# EAGLE design midi_pad_laser_optimized2 (EAGLE 9.6.2)
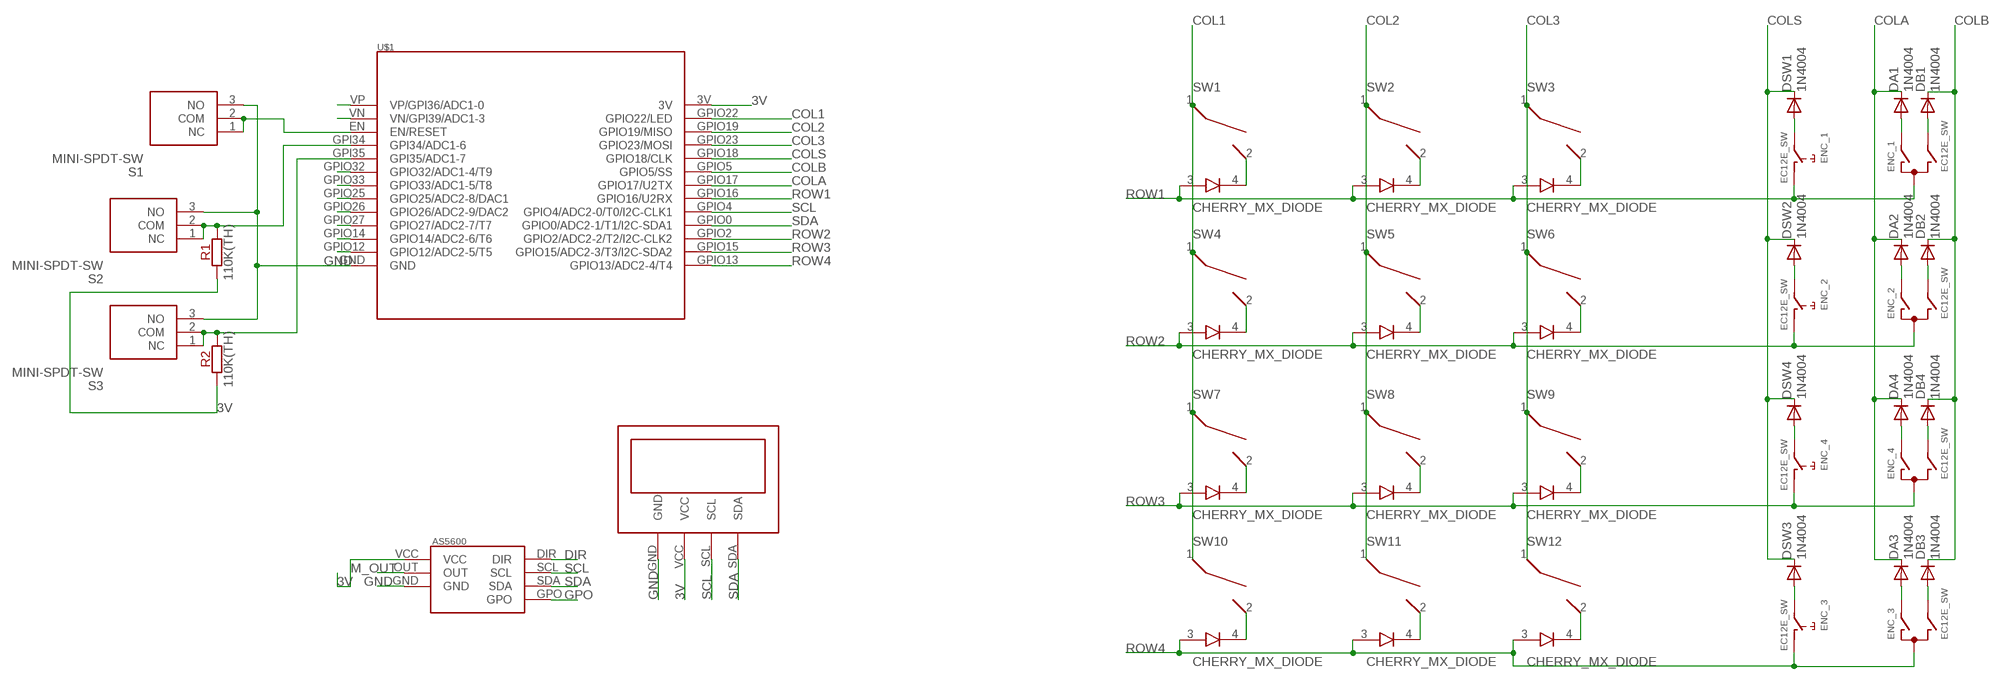
[diagram p0: schematic, sheet 1]

## Parts
DA1  1N4004  [DO41-10]
DA2  1N4004  [DO41-10]
DA3  1N4004  [DO41-10]
DA4  1N4004  [DO41-10]
DB1  1N4004  [DO41-10]
DB2  1N4004  [DO41-10]
DB3  1N4004  [DO41-10]
DB4  1N4004  [DO41-10]
DSW1  1N4004  [DO41-10]
DSW2  1N4004  [DO41-10]
DSW3  1N4004  [DO41-10]
DSW4  1N4004  [DO41-10]
ENC_1  EC12E_SW  [ALPS_EC12E_SW]
ENC_2  EC12E_SW  [ALPS_EC12E_SW]
ENC_3  EC12E_SW  [ALPS_EC12E_SW]
ENC_4  EC12E_SW  [ALPS_EC12E_SW]
R1  110K(TH)  [R-0207/10]
R2  110K(TH)  [R-0207/10]
S1  MINI-SPDT-SW  [MINISPDTSW]
S2  MINI-SPDT-SW  [MINISPDTSW]
S3  MINI-SPDT-SW  [MINISPDTSW]
SW1  CHERRY_MX_DIODE  [MX1A-XX[D/J]N]
SW2  CHERRY_MX_DIODE  [MX1A-XX[D/J]N]
SW3  CHERRY_MX_DIODE  [MX1A-XX[D/J]N]
SW4  CHERRY_MX_DIODE  [MX1A-XX[D/J]N]
SW5  CHERRY_MX_DIODE  [MX1A-XX[D/J]N]
SW6  CHERRY_MX_DIODE  [MX1A-XX[D/J]N]
SW7  CHERRY_MX_DIODE  [MX1A-XX[D/J]N]
SW8  CHERRY_MX_DIODE  [MX1A-XX[D/J]N]
SW9  CHERRY_MX_DIODE  [MX1A-XX[D/J]N]
SW10  CHERRY_MX_DIODE  [MX1A-XX[D/J]N]
SW11  CHERRY_MX_DIODE  [MX1A-XX[D/J]N]
SW12  CHERRY_MX_DIODE  [MX1A-XX[D/J]N]
U$1  LOLIN32_LITE  [LOLIN32_LITE]
U$2  AS5600_BREAKOUT  [AS5600_BREAKOUT]
U$3  I2C_OLED_128X64  [I2C_OLED_128X64_BREAKOUT]

## Nets
3V: R1.1 R2.1 U$1.3V U$2.VCC U$3.VCC
COL1: SW1.1 SW4.1 SW7.1 SW10.1 U$1.GPIO22(GPIO22/LED)
COL2: SW2.1 SW5.1 SW8.1 SW11.1 U$1.GPIO19(GPIO19/MISO)
COL3: SW3.1 SW6.1 SW9.1 SW12.1 U$1.GPIO23(GPIO23/MOSI)
COLA: DA1.C DA2.C DA3.C DA4.C U$1.GPIO17(GPIO17/U2TX)
COLB: DB1.C DB2.C DB3.C DB4.C U$1.GPIO5(GPIO5/SS)
COLS: DSW1.C DSW2.C DSW3.C DSW4.C U$1.GPIO18(GPIO18/CLK)
DIR: U$2.DIR
GND: S1.3(NO) S2.3(NO) S3.3(NO) U$1.GND U$2.GND U$3.GND
GPO: U$2.GPO
M_OUT: U$2.OUT
N$1: SW1.2 SW1.4
N$2: SW2.2 SW2.4
N$3: SW3.2 SW3.4
N$4: SW4.2 SW4.4
N$5: SW5.2 SW5.4
N$6: SW6.2 SW6.4
N$7: SW7.2 SW7.4
N$8: SW8.2 SW8.4
N$9: SW9.2 SW9.4
N$10: SW10.2 SW10.4
N$11: SW11.2 SW11.4
N$12: SW12.2 SW12.4
N$13: U$1.GPIO32(GPIO32/ADC1-4/T9)
N$14: S1.1(NC) S1.2(COM) U$1.EN(EN/RESET)
N$15: R1.2 S2.1(NC) S2.2(COM) U$1.GPI34(GPI34/ADC1-6)
N$16: R2.2 S3.1(NC) S3.2(COM) U$1.GPI35(GPI35/ADC1-7)
N$20: DSW1.A ENC_1.E
N$21: DA1.A ENC_1.A
N$22: DB1.A ENC_1.B
N$23: DSW2.A ENC_2.E
N$24: DA2.A ENC_2.A
N$25: DB2.A ENC_2.B
N$26: DSW3.A ENC_3.E
N$27: DA3.A ENC_3.A
N$28: DB3.A ENC_3.B
N$29: DSW4.A ENC_4.E
N$30: DA4.A ENC_4.A
N$31: DB4.A ENC_4.B
N$34: U$1.GPIO33(GPIO33/ADC1-5/T8)
N$35: U$1.GPIO25(GPIO25/ADC2-8/DAC1)
N$36: U$1.GPIO26(GPIO26/ADC2-9/DAC2)
N$43: U$1.GPIO27(GPIO27/ADC2-7/T7)
N$44: U$1.GPIO14(GPIO14/ADC2-6/T6)
N$45: U$1.GPIO12(GPIO12/ADC2-5/T5)
N$46: U$1.VN(VN/GPI39/ADC1-3)
N$47: U$1.VP(VP/GPI36/ADC1-0)
ROW1: ENC_1.C ENC_1.D SW1.3 SW2.3 SW3.3 U$1.GPIO16(GPIO16/U2RX)
ROW2: ENC_2.C ENC_2.D SW4.3 SW5.3 SW6.3 U$1.GPIO2(GPIO2/ADC2-2/T2/I2C-CLK2)
ROW3: ENC_4.C ENC_4.D SW7.3 SW8.3 SW9.3 U$1.GPIO15(GPIO15/ADC2-3/T3/I2C-SDA2)
ROW4: ENC_3.C ENC_3.D SW10.3 SW11.3 SW12.3 U$1.GPIO13(GPIO13/ADC2-4/T4)
SCL: U$1.GPIO4(GPIO4/ADC2-0/T0/I2C-CLK1) U$2.SCL U$3.SCL
SDA: U$1.GPIO0(GPIO0/ADC2-1/T1/I2C-SDA1) U$2.SDA U$3.SDA
Unconnected: ENC_1.GND1(G) ENC_1.GND2(G) ENC_2.GND1(G) ENC_2.GND2(G) ENC_3.GND1(G) ENC_3.GND2(G) ENC_4.GND1(G) ENC_4.GND2(G)

## Library data of the parts
DA1-DA4 DB1-DB4 DSW1-DSW4 = adafruit:1N4004: DIODE General purpose 1N400x type rectifier (With bigger pads) http://www.ladyada.net/library/pcb/eaglelibrary.html
ENC_1-ENC_4 = my-switch-alps:EC12E_SW: ALPS rotary Encoder EC12E series with switch; MPN: EC12E2424407; OC_FARNELL: 1520813; OC_NEWARK: 74M1068
R1 R2 = resistors:?
S1-S3 = SamacSys_Parts:MINI-SPDT-SW: Slide Switches MINI SPDT SWITCH Source: Datasheet <http://site.gravitech.us/Components/MINI-SPDT-SW/EG1218_datasheet.pdf>; DESCRIPTION: Slide Switches MINI SPDT SWITCH; HEIGHT: mm; MANUFACTURER_NAME: Gravitech; MANUFACTURER_PART_NUMBER: MINI-SPDT-SW; MOUSER_PART_NUMBER: 992-MINI-SPDT-SW; MOUSER_PRICE-STOCK: https://www.mouser.co.uk/ProductDetail/Gravitech/MINI-SPDT-SW?qs=Vxac6xGyzPm8ENq695r3yA%3D%3D
SW1-SW12 = Cherry_MX_v7.0:CHERRY_MX_DIODE
U$1 = my_breakouts:LOLIN32_LITE
U$2 = my_breakouts:AS5600_BREAKOUT
U$3 = my_breakouts:I2C_OLED_128X64

## Board
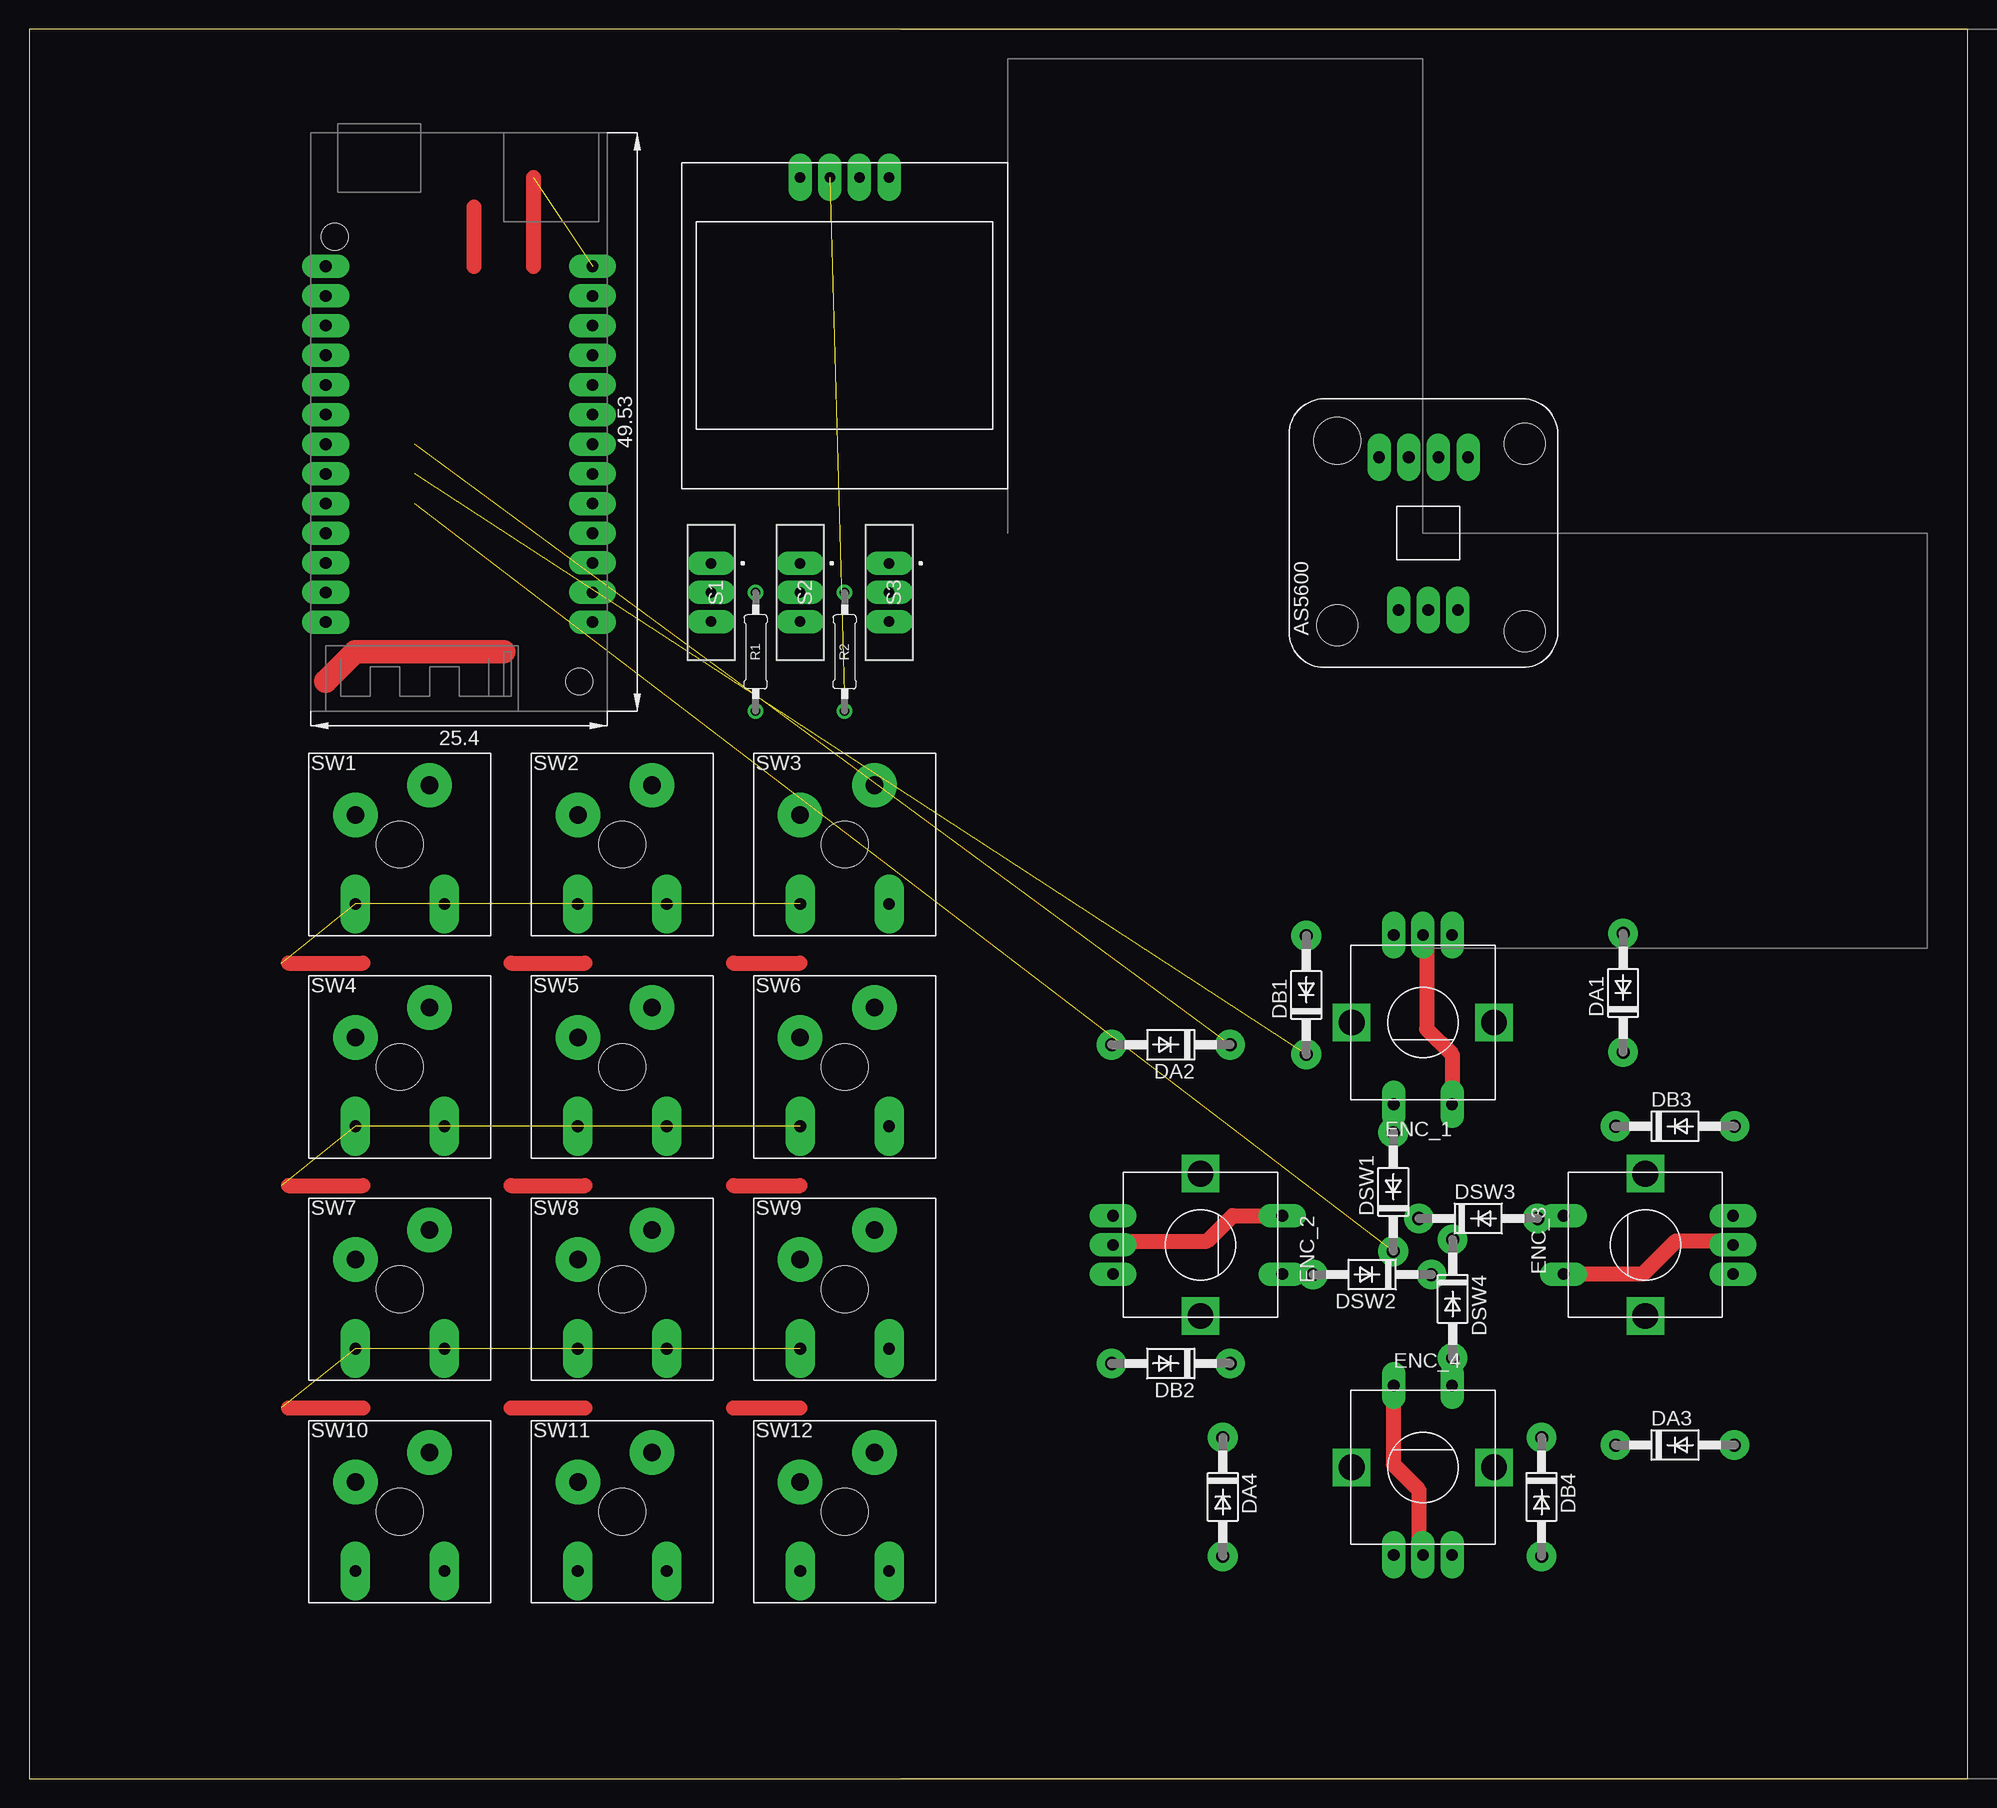
[diagram p1: board, top side]
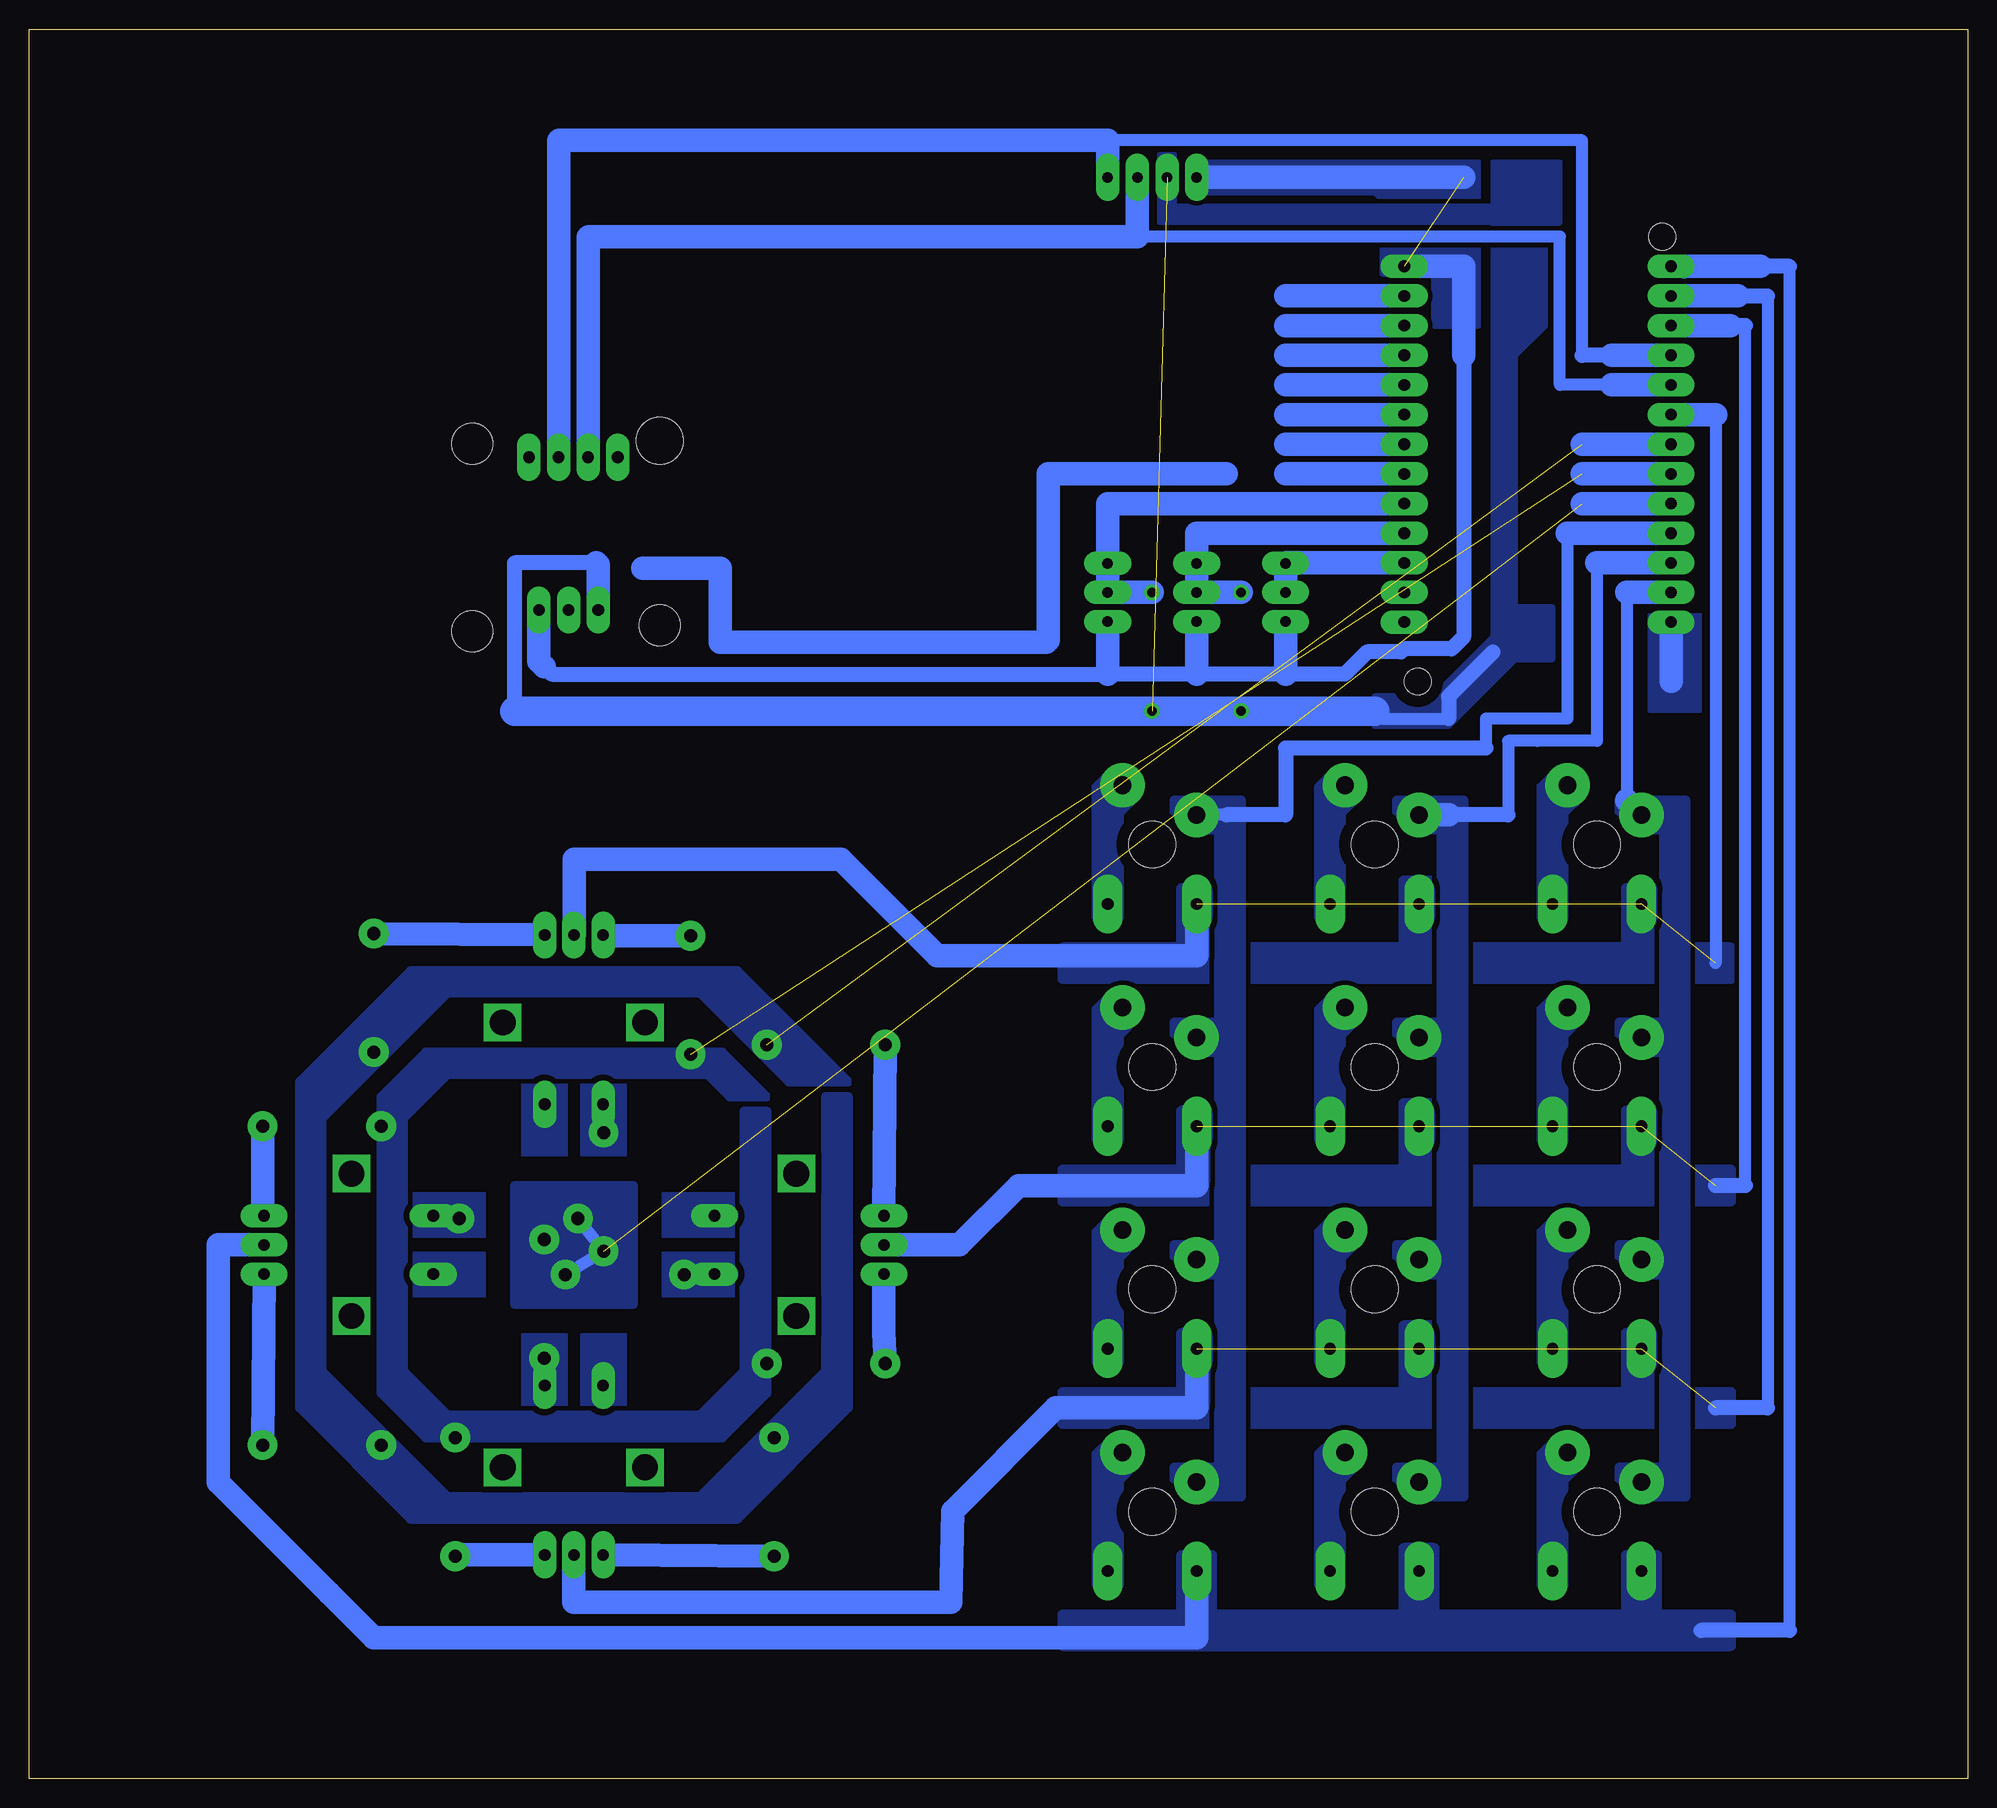
[diagram p2: board, bottom side, seen from below]

Size 166.04 x 149.85 mm. Coordinates in mm from the lower left corner, seen from the top.
Outline: 0,0 166.04,0 166.04,149.85 0,149.85 0,0
Copper layers (1*16): Top 0.035mm / dielectric 1.5mm / Bottom 0.035mm
Design rules "default *": minimum track width 6mil, minimum drill 0.35mm, track to track 0.4mm, track to pad 0.4mm, pad to pad 0.4mm, via to via 0.4mm, smd to smd 6mil, copper to edge 40mil, drill to drill 6mil, minimum pad ring 10mil, minimum via ring 8mil, stop-mask expansion 4mil, vias tented up to drill 0mil, thermal gap 10mil

### Footprints (pad centres in the part's own frame; a part is rotated, then mirrored left to right if it is on the bottom)
DO41-10 = drill 1.118 pad 2.54: A 5.08,0; C -5.08,0
ALPS_EC12E_SW = drill 1 pad 2.032 long: A -2.5,-7.5; B 2.5,-7.5; C 0,-7.5; D -2.5,7; E 2.5,7 | drill 2.2 square: GND1 -6.1,0; GND2 6.1,0
R-0207/10 = drill 0.813: 1 -5.08,0; 2 5.08,0
MINISPDTSW = drill 0.9 pad 2.032 long: 1 -2.5,0; 2 0,0; 3 2.5,0
MX1A-XX[D/J]N = drill 1.5 pad 3.81: 1 -3.81,2.54; 2 2.54,5.08 | drill 1 pad 2.54 long: 3 -3.81,-5.08; 4 3.81,-5.08 | hole 4: 0,0
LOLIN32_LITE = drill 1 pad 2.032 long: 3V 10.16,15.24; EN -12.7,10.16; GND -12.7,-15.24; GPI34 -12.7,7.62; GPI35 -12.7,5.08; GPIO0 10.16,-7.62; GPIO2 10.16,-10.16; GPIO4 10.16,-5.08; GPIO5 10.16,2.54; GPIO12 -12.7,-12.7; GPIO13 10.16,-15.24; GPIO14 -12.7,-10.16; GPIO15 10.16,-12.7; GPIO16 10.16,-2.54; GPIO17 10.16,0; GPIO18 10.16,5.08; GPIO19 10.16,10.16; GPIO22 10.16,12.7; GPIO23 10.16,7.62; GPIO25 -12.7,-2.54; GPIO26 -12.7,-5.08; GPIO27 -12.7,-7.62; GPIO32 -12.7,2.54; GPIO33 -12.7,0; VN -12.7,12.7; VP -12.7,15.24 | hole 2.286: 9.398,-17.78; -11.557,20.32
AS5600_BREAKOUT = drill 1 pad 2.032 long: DIR 6.504,3.758; GND -6.571,-2.995; GPO 6.504,-3.862; OUT -6.571,-0.455; SCL 6.504,1.218; SDA 6.504,-1.322; VCC -6.571,2.085 | hole 3.5: -8.401,-8.703; -7.893,7.351; 7.653,-8.703 | hole 4: 7.907,7.351
I2C_OLED_128X64_BREAKOUT = drill 0.9 pad 2.032 long: GND 3.81,-12.7; SCL -1.27,-12.7; SDA -3.81,-12.7; VCC 1.27,-12.7

### Placement (x,y rotation side)
DA1  136.53,67.31 90 top
DA2  97.79,62.87 180 top
DA3  140.97,28.57 0 top
DA4  102.23,24.13 270 top
DB1  109.39,67.12 90 top
DB2  97.79,35.56 180 top
DB3  140.97,55.88 0 top
DB4  129.54,24.13 270 top
DSW1  116.84,50.26 90 top
DSW2  115.03,43.18 180 top
DSW3  124.12,47.98 0 top
DSW4  121.92,41.1 270 top
ENC_1  119.38,64.77 180 top
ENC_2  100.33,45.72 270 top
ENC_3  138.43,45.72 90 top
ENC_4  119.38,26.67 0 top
R1  62.23,96.52 90 top
R2  69.85,96.52 90 top
S1  58.42,101.6 270 top
S2  66.04,101.6 270 top
S3  73.66,101.6 270 top
SW1  31.75,80.01 0 top
SW2  50.8,80.01 0 top
SW3  69.85,80.01 0 top
SW4  31.75,60.96 0 top
SW5  50.8,60.96 0 top
SW6  69.85,60.96 0 top
SW7  31.75,41.91 0 top
SW8  50.8,41.91 0 top
SW9  69.85,41.91 0 top
SW10  31.75,22.86 0 top
SW11  50.8,22.86 0 top
SW12  69.85,22.86 0 top
U$1  35.56,114.3 180 top
U$2  119.38,106.68 90 top
U$3  69.85,124.46 180 top

### Tracks (layer width: path | path; a pad name or v marks a point on that pad's centre or on a via)
3V  (3 unrouted)
  Top 2: 25.4,93.98 27.94,96.52 40.64,96.52
  Bottom 1.016: 44.45,90.81 50.16,90.81 50.8,91.44
  Bottom 1.27: 40.64,96.52 44.32,92.84 44.32,92.82 44.45,92.7 44.45,90.81 | 124.46,91.44 124.46,104.14 117.47,104.14 | R2.1 63.5,91.44
  Bottom 2: U$1.3V 25.4,93.98 | U$2.VCC 117.3,103.96 117.47,104.14
  Bottom 2.54: 50.8,91.44 R1.1 63.5,91.44 124.46,91.44
  pour Bottom (isolate 0.406, no thermals): 67.94,139.06 69.22,139.06 69.22,133.35 40.64,133.35 40.64,97.79 45.72,92.71 50.8,92.71 50.8,90.17 44.45,90.17 38.73,95.89 35.56,95.89 35.56,100.33 38.73,100.33 38.73,121.92 36.2,124.46 36.2,132.08 34.92,133.35 34.92,138.43 40.64,138.43 40.64,134.62 67.94,134.62
  pour Bottom (isolate 0.406, no thermals): 22.86,99.69 27.3,99.69 27.3,91.44 22.86,91.44
COL1
  Bottom 1.016: 29.21,101.6 29.21,83.82
  Bottom 2: U$1.GPIO22 29.21,101.6 | 29.21,83.82 SW1.1
  pour Bottom (isolate 0.533, no thermals): 24.13,24.13 29.84,24.13 29.84,26.67 26.04,26.67 26.04,43.18 29.84,43.18 29.84,45.72 26.04,45.72 26.04,62.23 29.84,62.23 29.84,64.77 26.04,64.77 26.04,81.28 29.84,81.28 29.84,83.82 24.13,83.82
COL2
  Bottom 1.016: 39.37,82.55 39.37,88.9 36.83,88.9 31.75,88.9 31.75,104.14
  Bottom 1.27: 39.37,82.55 44.45,82.55
  Bottom 2: U$1.GPIO19 31.75,104.14 | 44.45,82.55 SW2.1
  pour Bottom (isolate 0.533, no thermals): 43.18,24.13 48.9,24.13 48.9,26.67 45.09,26.67 45.09,43.18 48.9,43.18 48.9,45.72 45.09,45.72 45.09,62.23 48.9,62.23 48.9,64.77 45.09,64.77 45.09,81.28 48.9,81.28 48.9,83.82 43.18,83.82
COL3
  Bottom 1.016: 34.29,106.68 34.29,90.81 41.27,90.81 41.27,88.27 | 63.5,82.55 SW3.1
  Bottom 1.27: 41.27,88.27 58.42,88.27 58.42,82.55 63.5,82.55
  Bottom 2: U$1.GPIO23 34.29,106.68
  pour Bottom (isolate 0.533, no thermals): 62.23,24.13 67.94,24.13 67.94,26.67 64.14,26.67 64.14,43.18 67.94,43.18 67.94,45.72 64.14,45.72 64.14,62.23 67.94,62.23 67.94,64.77 64.14,64.77 64.14,81.28 67.94,81.28 67.94,83.82 62.23,83.82
COLA  (1 unrouted)
  Bottom 2: U$1.GPIO17 33.02,114.3
  pour Bottom (isolate 0.533, no thermals): 95.89,58.42 97.79,58.42 97.79,34.92 108.58,24.13 130.18,24.13 140.97,34.92 140.97,56.52 130.18,67.31 108.58,67.31 100.97,59.69 95.89,59.69 105.41,69.22 133.35,69.22 142.88,59.69 142.88,31.75 133.35,22.23 105.41,22.23 95.89,31.75
COLB  (1 unrouted)
  Bottom 2: U$1.GPIO5 33.02,111.76
  pour Bottom (isolate 0.533, rank 2, no thermals): 102.87,57.15 104.78,57.15 104.78,34.92 108.58,31.11 130.18,31.11 133.99,34.92 133.99,56.52 130.18,60.33 107.95,60.33 106.05,58.42 102.87,58.42 106.68,62.23 132.08,62.23 135.89,58.42 135.89,33.02 132.08,29.21 106.68,29.21 102.87,33.02
COLS  (1 unrouted)
  Bottom 1.016: DSW2.C DSW1.C DSW3.C
  Bottom 2: U$1.GPIO18 33.02,109.22
  pour Bottom (isolate 0.533, rank 3, no thermals): 114.3,50.8 114.3,40.64 124.46,40.64 124.46,50.8
GND  (1 unrouted)
  Bottom 1.27: 43.18,121.92 43.18,97.79 44.2,96.77 48.27,96.77 48.53,96.52 51.44,96.52 53.34,94.61 58.42,94.61 66.04,94.61 73.66,94.61 121.28,94.61 121.92,95.25
  Bottom 2: U$1.GND 43.18,129.54 43.18,121.92 | S1.3 58.42,94.61 | S2.3 66.04,94.61 | S3.3 73.66,94.61 | U$3.GND 43.18,137.16 | U$2.GND 122.38,95.7 121.92,95.25
  pour Bottom (isolate 0.406, rank 2, no thermals): 50.16,128.91 45.72,128.91 45.72,124.46 41.91,124.46 41.91,138.43 66.67,138.43 66.67,135.89 50.8,135.89 50.16,135.25
N$1
  pour Bottom (isolate 0.406, rank 3, no thermals): 33.02,86.36 33.02,83.82 34.29,82.55 34.29,73.66 36.83,73.66 36.83,85.09 35.56,86.36
N$2
  pour Bottom (isolate 0.406, rank 3, no thermals): 52.07,86.36 52.07,83.82 53.34,82.55 53.34,73.66 55.88,73.66 55.88,85.09 54.61,86.36
N$3
  pour Bottom (isolate 0.406, rank 3, no thermals): 71.12,86.36 71.12,83.82 72.39,82.55 72.39,73.66 74.93,73.66 74.93,85.09 73.66,86.36
N$4
  pour Bottom (isolate 0.406, rank 3, no thermals): 33.02,67.31 33.02,64.77 34.29,63.5 34.29,54.61 36.83,54.61 36.83,66.04 35.56,67.31
N$5
  pour Bottom (isolate 0.406, rank 3, no thermals): 52.07,67.31 52.07,64.77 53.34,63.5 53.34,54.61 55.88,54.61 55.88,66.04 54.61,67.31
N$6
  pour Bottom (isolate 0.406, rank 3, no thermals): 71.12,67.31 71.12,64.77 72.39,63.5 72.39,54.61 74.93,54.61 74.93,66.04 73.66,67.31
N$7
  pour Bottom (isolate 0.406, rank 3, no thermals): 33.02,48.26 33.02,45.72 34.29,44.45 34.29,35.56 36.83,35.56 36.83,46.99 35.56,48.26
N$8
  pour Bottom (isolate 0.406, rank 3, no thermals): 52.07,48.26 52.07,45.72 53.34,44.45 53.34,35.56 55.88,35.56 55.88,46.99 54.61,48.26
N$9
  pour Bottom (isolate 0.406, rank 3, no thermals): 71.12,48.26 71.12,45.72 72.39,44.45 72.39,35.56 74.93,35.56 74.93,46.99 73.66,48.26
N$10
  pour Bottom (isolate 0.406, rank 3, no thermals): 33.02,29.21 33.02,26.67 34.29,25.4 34.29,16.51 36.83,16.51 36.83,27.94 35.56,29.21
N$11
  pour Bottom (isolate 0.406, rank 3, no thermals): 52.07,29.21 52.07,26.67 53.34,25.4 53.34,16.51 55.88,16.51 55.88,27.94 54.61,29.21
N$12
  pour Bottom (isolate 0.406, rank 3, no thermals): 71.12,29.21 71.12,26.67 72.39,25.4 72.39,16.51 74.93,16.51 74.93,27.94 73.66,29.21
N$13
  Bottom 2: U$1.GPIO32 58.42,111.76
N$14
  Bottom 2: 58.34,101.68 S1.2 S1.1 58.38,104.14 U$1.EN 53.95,104.14
N$15
  Bottom 2: U$1.GPI34 66.04,106.68 S2.1 S2.2 R1.2
N$16
  Bottom 2: R2.2 S3.2 S3.1 73.66,109.22 U$1.GPI35
N$17
  Top 1.27: 38.1,134.62 38.1,129.54
N$18
  Top 1.27: 43.18,137.16 43.18,129.54
N$19
  Top 1.27: 22.23,69.85 28.57,69.85
N$20
  Bottom 1.016: ENC_1.E DSW1.A
  pour Bottom (isolate 0.406, rank 4, no thermals): 114.94,53.34 118.75,53.34 118.75,59.69 114.94,59.69
N$21
  Bottom 2: ENC_1.A DA1.A
N$22
  Bottom 0.813: 116.83,72.22 ENC_1.B
  Bottom 2: DB1.A 116.83,72.22
N$23
  Bottom 1.016: ENC_2.E DSW2.A
  pour Bottom (isolate 0.406, rank 4, no thermals): 105.41,45.09 105.41,41.27 111.76,41.27 111.76,45.09
N$24
  Bottom 2: DA2.A ENC_2.A
N$25
  Bottom 2: ENC_2.B 92.83,38.22 DB2.A
N$26
  Bottom 1.016: DSW3.A ENC_3.E
  pour Bottom (isolate 0.406, rank 4, no thermals): 127,50.16 127,46.35 133.35,46.35 133.35,50.16
N$27
  Bottom 1.016: ENC_3.A
  Bottom 2: DA3.A ENC_3.A
N$28
  Bottom 0.813: 146.05,48.34 ENC_3.B
  Bottom 2: DB3.A 146.05,48.34
N$29
  Bottom 1.016: DSW4.A ENC_4.E
  pour Bottom (isolate 0.406, rank 4, no thermals): 120.02,31.75 123.83,31.75 123.83,38.1 120.02,38.1
N$30
  Bottom 1.016: ENC_4.A
  Bottom 2: ENC_4.A DA4.A
N$31
  Bottom 0.813: 128.92,19.17 DB4.A
  Bottom 2: ENC_4.B 128.92,19.17
N$32
  Top 1.27: 41.27,69.85 47.62,69.85
N$33
  Top 1.27: 60.33,69.85 66.04,69.85
N$34
  Bottom 2: U$1.GPIO33 58.42,114.3
N$35
  Bottom 2: U$1.GPIO25 58.42,116.84
N$36
  Bottom 2: U$1.GPIO26 58.42,119.38
N$37
  Top 1.27: 22.23,50.8 28.57,50.8
N$38
  Top 1.27: 41.27,50.8 47.62,50.8
N$39
  Top 1.27: 60.33,50.8 66.04,50.8
N$40
  Top 1.27: 22.23,31.75 28.57,31.75
N$41
  Top 1.27: 41.27,31.75 47.62,31.75
N$42
  Top 1.27: 60.33,31.75 66.04,31.75
N$43
  Bottom 2: U$1.GPIO27 58.42,121.92
N$44
  Bottom 2: U$1.GPIO14 58.42,124.46
N$45
  Bottom 2: U$1.GPIO12 58.42,127
N$48
  Bottom 2: 63.5,111.76 78.74,111.76 78.74,97.51 78.93,97.32 106.83,97.32 106.83,103.66 113.49,103.66
ROW1  (3 unrouted)
  Top 1.27: ENC_1.C 119.7,71.95 119.7,64.2 121.88,62.03 ENC_1.D
  Bottom 1.016: 21.59,116.84 21.59,69.85
  Bottom 2: ENC_1.C 119.36,72.29 119.36,78.74 96.52,78.74 88.27,70.48 66.04,70.48 SW3.3 | U$1.GPIO16 21.59,116.84
  pour Bottom (isolate 0.406, rank 2, no thermals): 26.67,76.2 29.21,76.2 29.21,71.12 45.72,71.12 45.72,76.83 48.26,76.83 48.26,71.12 64.77,71.12 64.77,76.2 67.31,76.2 67.31,71.12 77.47,71.12 77.47,68.58 20.32,68.58 20.32,71.12 26.67,71.12
  pour Bottom (isolate 0.406, rank 4, no thermals): 120.02,53.34 123.83,53.34 123.83,59.69 120.02,59.69
ROW2  (3 unrouted)
  Top 1.27: ENC_2.C 93.15,46.04 100.89,46.04 103.07,48.22 ENC_2.D
  Bottom 1.016: 19.05,50.8 19.05,124.46
  Bottom 1.27: 19.05,50.8 21.59,50.8 | 19.05,124.46 20.32,124.46
  Bottom 2: SW6.3 66.04,50.8 81.28,50.8 86.36,45.72 ENC_2.C | 20.32,124.46 U$1.GPIO2
  pour Bottom (isolate 0.406, rank 2, no thermals): 26.67,57.15 29.21,57.15 29.21,52.07 45.72,52.07 45.72,57.78 48.26,57.78 48.26,52.07 64.77,52.07 64.77,57.15 67.31,57.15 67.31,52.07 77.47,52.07 77.47,49.53 20.32,49.53 20.32,52.07 26.67,52.07
  pour Bottom (isolate 0.406, rank 4, no thermals): 111.76,46.35 111.76,50.16 105.41,50.16 105.41,46.35
ROW3  (3 unrouted)
  Top 1.27: ENC_4.C 119.06,19.49 119.06,24.7 116.88,26.87 ENC_4.D
  Bottom 1.016: 17.14,127 17.14,31.75
  Bottom 1.27: 19.68,127 17.14,127 | 17.14,31.75 21.59,31.75
  Bottom 2: SW9.3 66.04,31.76 78.1,31.76 86.93,22.92 87.12,15.1 119.38,15.1 ENC_4.C | U$1.GPIO15 19.68,127
  pour Bottom (isolate 0.406, rank 2, no thermals): 26.67,38.1 29.21,38.1 29.21,33.02 45.72,33.02 45.72,38.73 48.26,38.73 48.26,33.02 64.77,33.02 64.77,38.1 67.31,38.1 67.31,33.02 77.47,33.02 77.47,30.48 20.32,30.48 20.32,33.02 26.67,33.02
  pour Bottom (isolate 0.406, rank 4, no thermals): 114.94,31.75 118.75,31.75 118.75,38.1 114.94,38.1
ROW4
  Top 1.27: ENC_3.C 145.62,46.03 141.04,46.03 138.23,43.22 ENC_3.D
  Bottom 1.016: 15.24,12.7 15.24,129.54
  Bottom 1.27: 15.24,12.7 22.86,12.7 | 15.24,129.54 17.78,129.54
  Bottom 2: SW12.3 66.04,12.06 136.53,12.06 140.34,15.88 149.86,25.4 149.86,45.72 ENC_3.C | 17.78,129.54 24.23,129.54 | 24.23,129.54 24.26,129.52 | U$1.GPIO13 24.23,129.54
  pour Bottom (isolate 0.406, rank 2, no thermals): 26.67,19.05 29.21,19.05 29.21,13.97 45.72,13.97 45.72,19.68 48.26,19.68 48.26,13.97 64.77,13.97 64.77,19.05 67.31,19.05 67.31,13.97 77.47,13.97 77.47,11.43 20.32,11.43 20.32,13.97 26.67,13.97
  pour Bottom (isolate 0.406, rank 4, no thermals): 133.35,41.27 133.35,45.09 127,45.09 127,41.27
SCL
  Bottom 1.016: 30.48,119.38 34.92,119.38 34.92,132.08 71.12,132.08
  Bottom 2: U$1.GPIO4 30.48,119.38 | U$3.SCL 71.12,132.08 116.77,132.08 118.11,132.08 118.16,132.03 U$2.SCL
SDA
  Bottom 1.016: 33.02,121.92 33.02,140.34 73.66,140.34
  Bottom 1.27: 30.48,121.92 33.02,121.92
  Bottom 2: U$1.GPIO0 30.48,121.92 | U$3.SDA 73.66,140.34 110.28,140.34 120.65,140.34 120.7,140.28 U$2.SDA